# Altium schematic sheet PWR_IN.SchDoc
size C
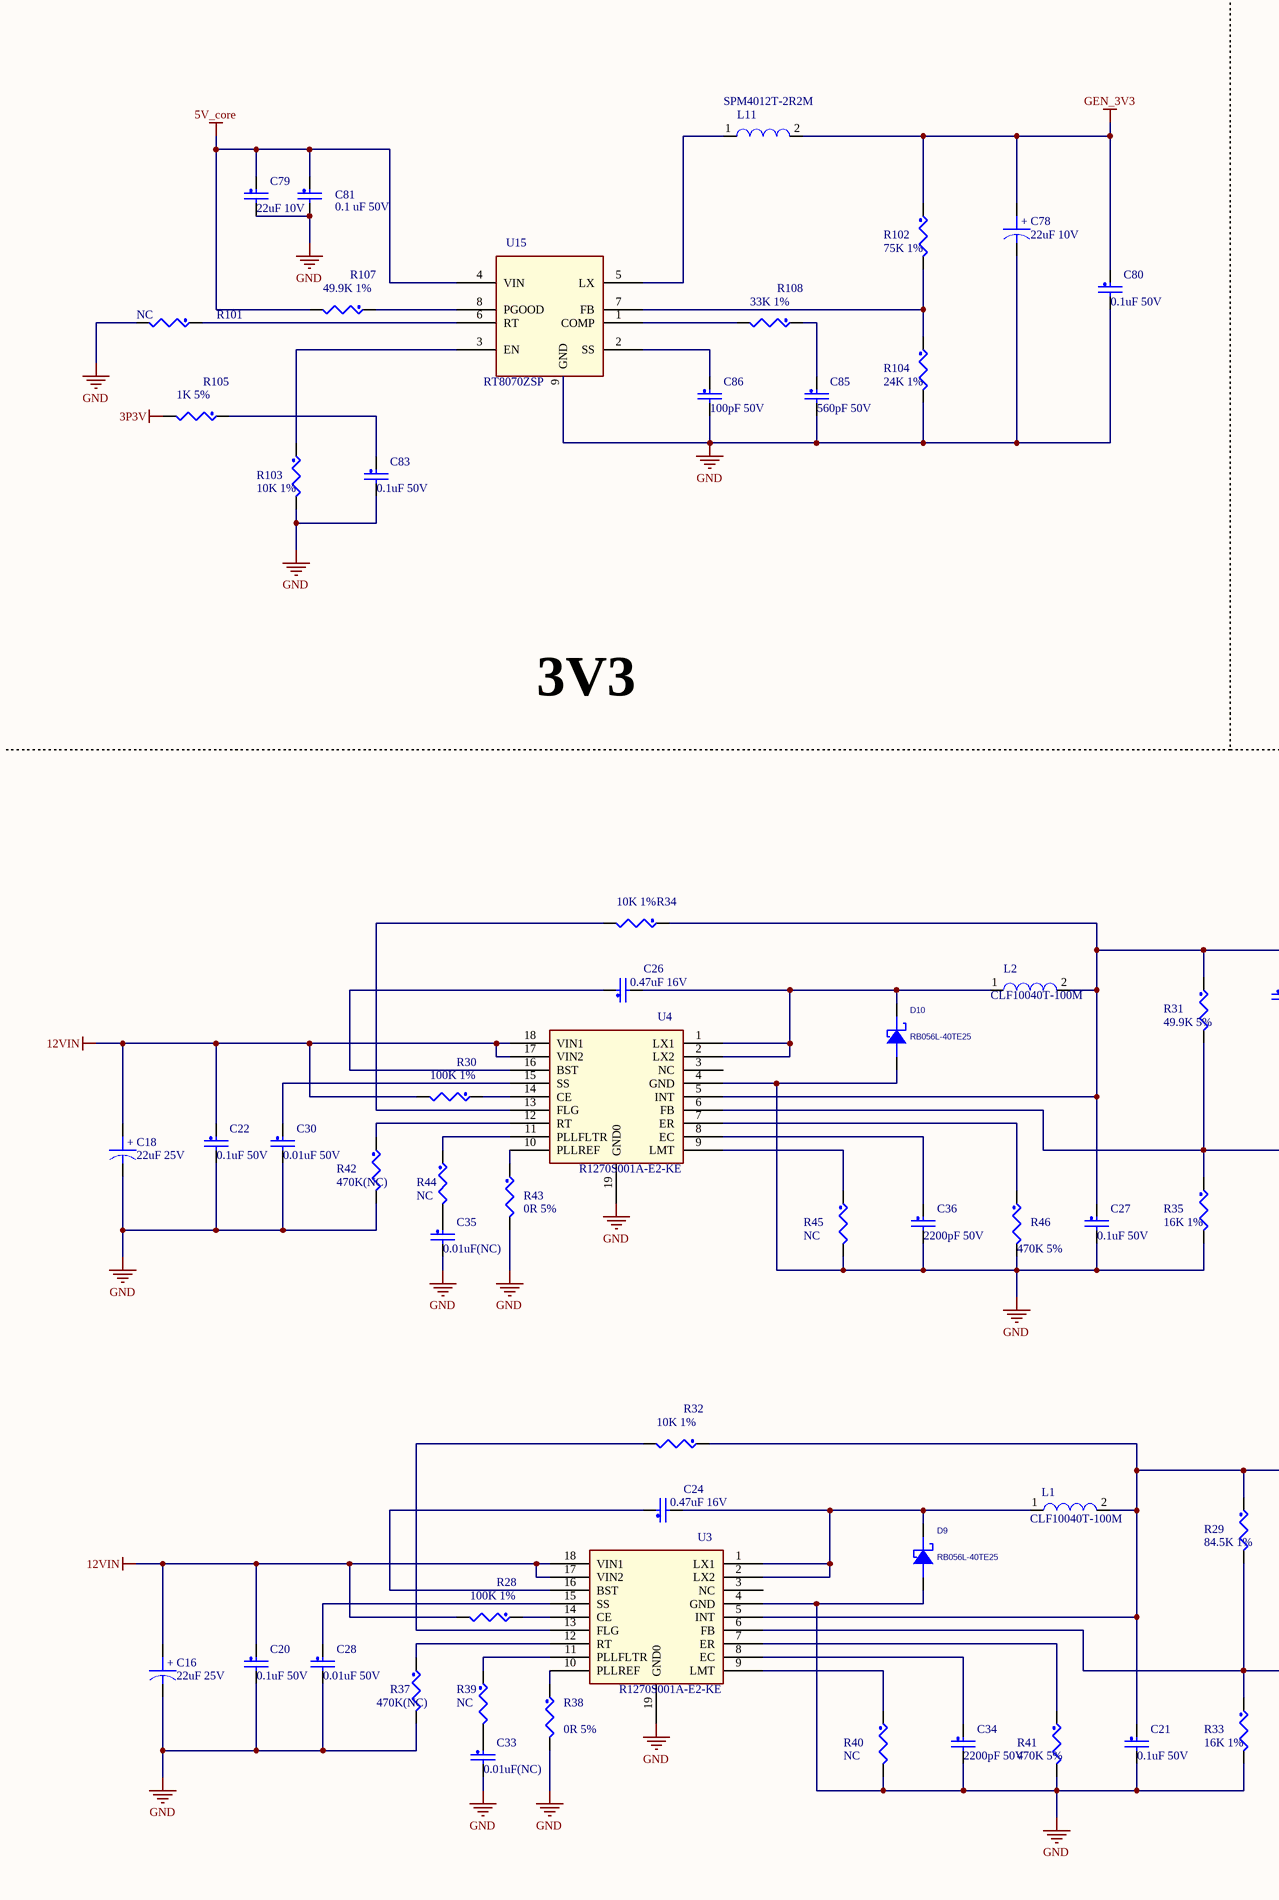
[diagram p0: PWR_IN.SchDoc, left]
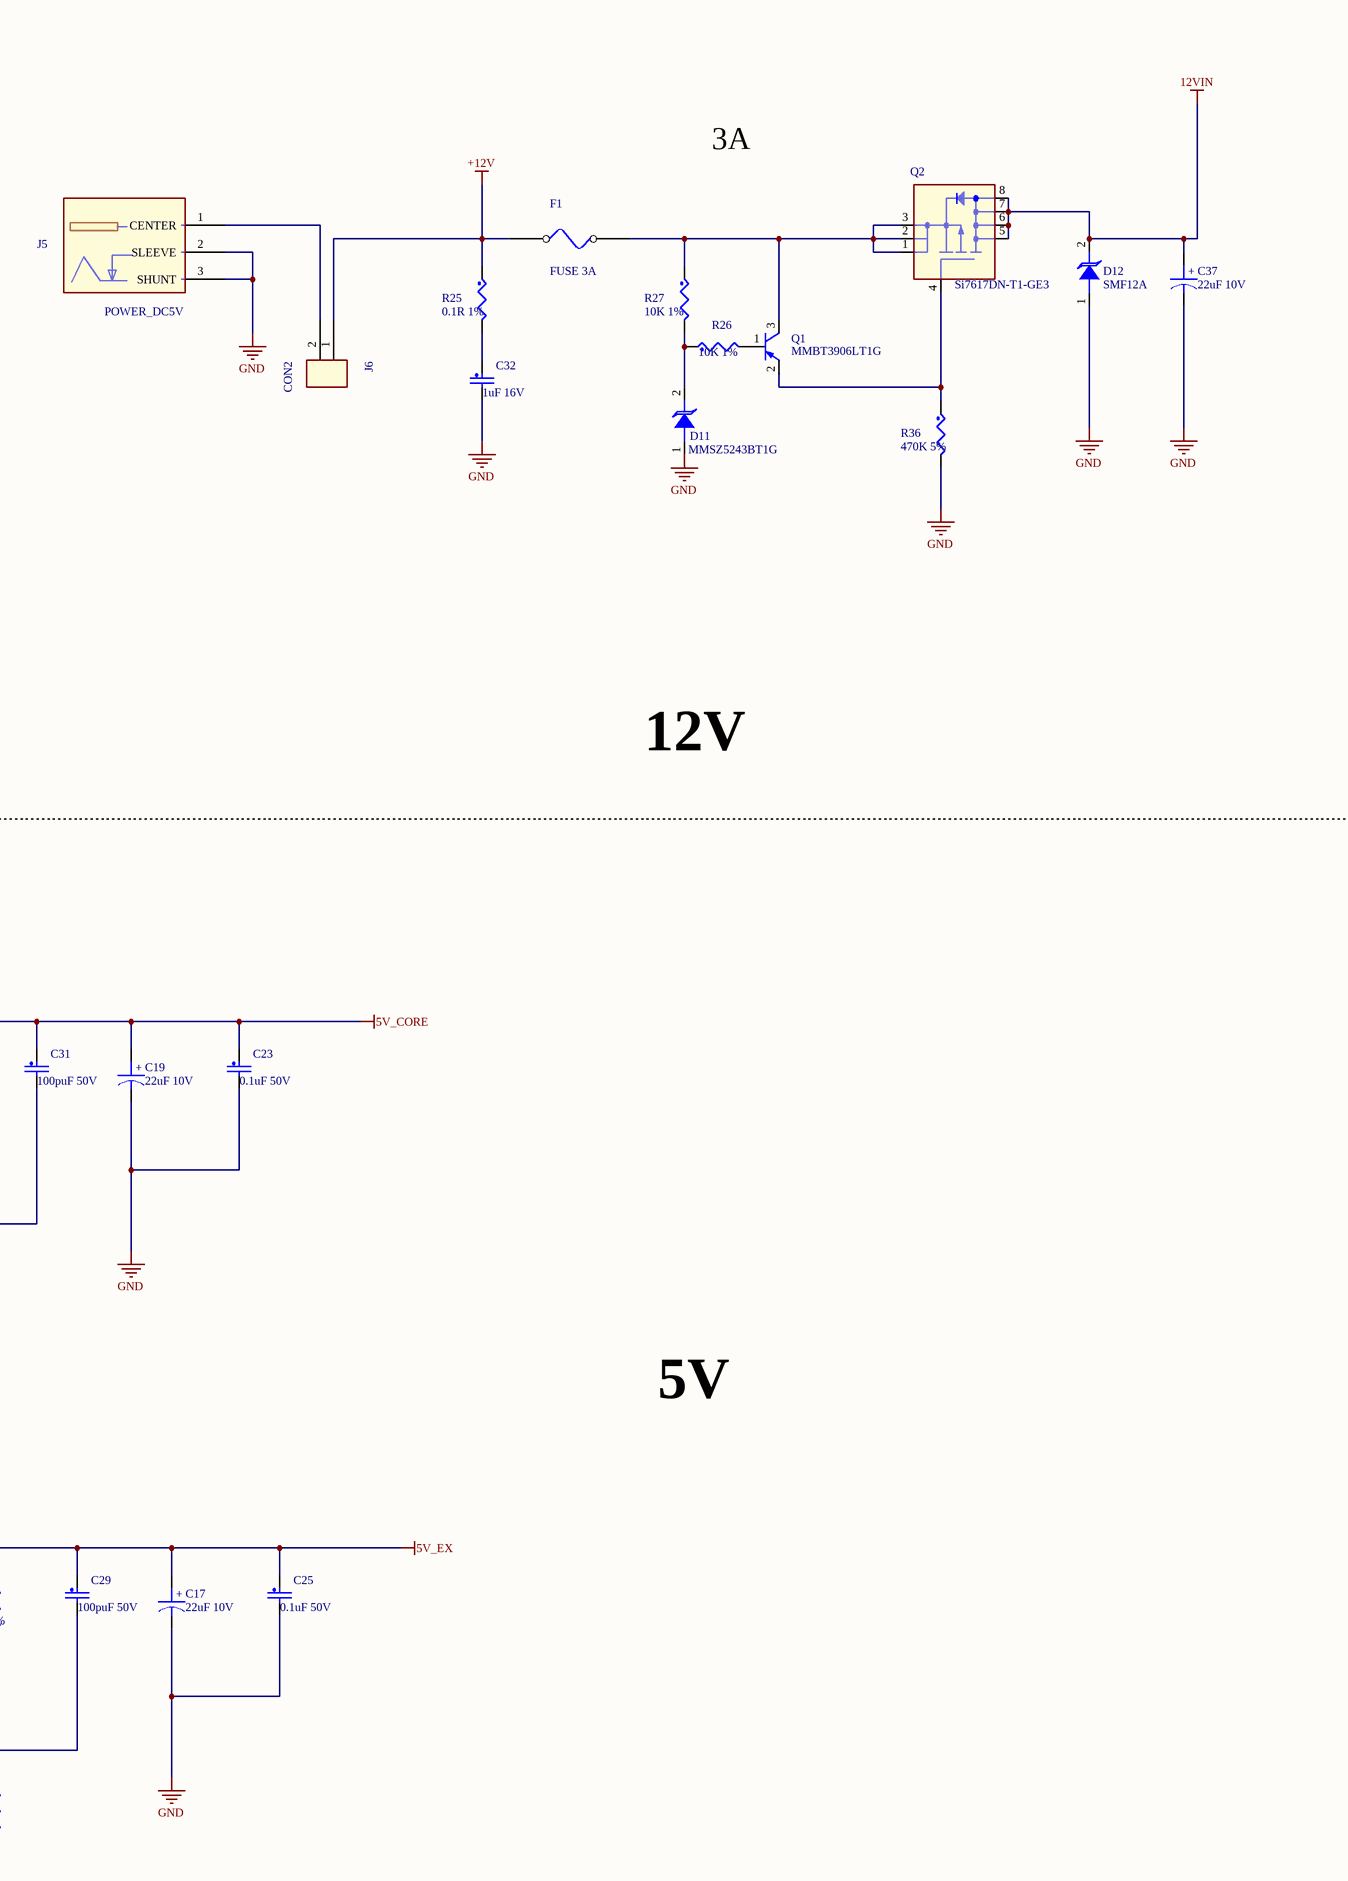
[diagram p1: PWR_IN.SchDoc, right]

## Parts
C16  22uF 25V  [SC0805]
C17  22uF 10V  [SC0805]
C18  22uF 25V  [SC0805]
C19  22uF 10V  [SC0805]
C20  0.1uF 50V  [SC0603]
C21  0.1uF 50V  [SC0603]
C22  0.1uF 50V  [SC0603]
C23  0.1uF 50V  [SC0603]
C24  0.47uF 16V  [SC0603]
C25  0.1uF 50V  [SC0603]
C26  0.47uF 16V  [SC0603]
C27  0.1uF 50V  [SC0603]
C28  0.01uF 50V  [SC0603]
C29  100puF 50V  [SC0603]
C30  0.01uF 50V  [SC0603]
C31  100puF 50V  [SC0603]
C32  1uF 16V  [SC0603]
C33  0.01uF(NC)  [SC0603]
C34  2200pF 50V  [SC0603]
C35  0.01uF(NC)  [SC0603]
C36  2200pF 50V  [SC0603]
C37  22uF 10V  [SC0805]
C78  22uF 10V  [SC0805]
C79  22uF 10V  [SC0603]
C80  0.1uF 50V  [SC0603]
C81  0.1 uF 50V  [SC0603]
C83  0.1uF 50V  [SC0603]
C85  560pF 50V  [SC0603]
C86  100pF 50V  [SC0603]
D9  RB056L-40TE25  [DO-214AC]
D10  RB056L-40TE25  [DO-214AC]
D11  MMSZ5243BT1G  [SOD123]
D12  SMF12A  [SOD123]
F1  FUSE 3A  [SF1812]
J5  POWER_DC5V  [DC-005-1P65]
J6  CON2  [SW2-10P4X15-1-8]
L1  CLF10040T-100M  [SPM10X9P7]
L2  CLF10040T-100M  [SPM10X9P7]
L11  SPM4012T-2R2M  [SPM4X4]
Q1  MMBT3906LT1G  [SOT23-3]
Q2  Si7617DN-T1-GE3  [QFN8-0P66-4P3X3P3]
R25  0.1R 1%  [SR0603]
R26  10K 1%  [SR0603]
R27  10K 1%  [SR0603]
R28  100K 1%  [SR0603]
R29  84.5K 1%  [SR0603]
R30  100K 1%  [SR0603]
R31  49.9K 5%  [SR0603]
R32  10K 1%  [SR0603]
R33  16K 1%  [SR0603]
R34  10K 1%  [SR0603]
R35  16K 1%  [SR0603]
R36  470K 5%  [SR0603]
R37  470K(NC)  [SR0603]
R38  0R 5%  [SR0603]
R39  NC  [SR0603]
R40  NC  [SR0603]
R41  470K 5%  [SR0603]
R42  470K(NC)  [SR0603]
R43  0R 5%  [SR0603]
R44  NC  [SR0603]
R45  NC  [SR0603]
R46  470K 5%  [SR0603]
R101  NC  [SR0603]
R102  75K 1%  [SR0603]
R103  10K 1%  [SR0603]
R104  24K 1%  [SR0603]
R105  1K 5%  [SR0603]
R107  49.9K 1%  [SR0603]
R108  33K 1%  [SR0603]
U3  R1270S001A-E2-KE  [HSOP18-0P5-5P2X4P4-P]
U4  R1270S001A-E2-KE  [HSOP18-0P5-5P2X4P4-P]
U15  RT8070ZSP  [SOP8-1P27-5X4-P]

## Nets
3P3V: R105.2
5V_core: C19.1 C23.1 C27.1 C31.1 C79.1 C81.1 L2.2 R31.1 R34.1 R107.2 U4.5(INT) U15.4(VIN)
5V_EX: C17.1 C21.1 C25.1 C29.1 L1.2 R29.1 R32.1 U3.5(INT)
12VIN: C16.1 C18.1 C20.1 C22.1 C37.1 D12.2(C) Q2.5(D5) Q2.6(D6) Q2.7(D7) Q2.8(D8) R28.2 R30.2 U3.17(VIN2) U3.18(VIN1) U4.17(VIN2) U4.18(VIN1)
+12V: F1.1 J6.1 R25.1
GEN_3V3: C78.1 C80.1 L11.2 R102.1
GND: C16.2 C17.2 C18.2 C19.2 C20.2 C21.2 C22.2 C23.2 C25.2 C27.2 C28.2 C30.2 C32.2 C33.2 C34.2 C35.2 C36.2 C37.2 C78.2 C79.2 C80.2 C81.2 C83.2 C85.2 C86.2 D9.1(ANODE) D10.1(ANODE) D11.1(A) D12.1(A) J5.2(SLEEVE) J5.3(SHUNT) R33.2 R35.2 R36.2 R37.2 R38.2 R40.2 R41.2 R42.2 R43.2 R45.2 R46.2 R101.2 R103.2 R104.2 U3.4(GND) U3.19(GND0) U4.4(GND) U4.19(GND0) U15.9(GND)
NetC24_1: C24.1 U3.16(BST)
NetC24_2: C24.2 D9.2(CATHODE) L1.1 U3.1(LX1) U3.2(LX2)
NetC26_1: C26.1 U4.16(BST)
NetC26_2: C26.2 D10.2(CATHODE) L2.1 U4.1(LX1) U4.2(LX2)
NetC28_1: C28.1 U3.15(SS)
NetC29_2: C29.2 R29.2 R33.1 U3.6(FB)
NetC30_1: C30.1 U4.15(SS)
NetC31_2: C31.2 R31.2 R35.1 U4.6(FB)
NetC32_1: C32.1 R25.2
NetC33_1: C33.1 R39.2
NetC34_1: C34.1 U3.8(EC)
NetC35_1: C35.1 R44.2
NetC36_1: C36.1 U4.8(EC)
NetC83_1: C83.1 R105.1
NetC85_1: C85.1 R108.1
NetC86_1: C86.1 U15.2(SS)
NetD11_2: D11.2(C) R26.1 R27.2
NetF1_2: F1.2 Q1.3(O) Q2.1(S1) Q2.2(S2) Q2.3(S3) R27.1
NetJ5_1: J5.1(CENTER) J6.2
NetL11_1: L11.1 U15.5(LX)
NetQ1_1: Q1.1(B) R26.2
NetQ1_2: Q1.2(E) Q2.4(G) R36.1
NetR28_1: R28.1 U3.14(CE)
NetR30_1: R30.1 U4.14(CE)
NetR32_2: R32.2 U3.13(FLG)
NetR34_2: R34.2 U4.13(FLG)
NetR37_1: R37.1 U3.12(RT)
NetR38_1: R38.1 U3.10(PLLREF)
NetR39_1: R39.1 U3.11(PLLFLTR)
NetR40_1: R40.1 U3.9(LMT)
NetR41_1: R41.1 U3.7(ER)
NetR42_1: R42.1 U4.12(RT)
NetR43_1: R43.1 U4.10(PLLREF)
NetR44_1: R44.1 U4.11(PLLFLTR)
NetR45_1: R45.1 U4.9(LMT)
NetR46_1: R46.1 U4.7(ER)
NetR101_1: R101.1 U15.6(RT)
NetR102_2: R102.2 R104.1 U15.7(FB)
NetR103_1: R103.1 U15.3(EN)
NetR107_1: R107.1 U15.8(PGOOD)
NetR108_2: R108.2 U15.1(COMP)

Not connected (* = marked no-connect by the designer): U3 3(NC); U4 3(NC)

## Notes on the sheet
- 3A
- 12V
- 3V3
- 5V
- (in symbol CAP POL) +

## Library data of the parts
C16-C19 C37 C78 = CAP POL
C20-C36 C79-C81 C83 C85 C86 = CAP_NP: CLASS: DISCRETE
D9 D10 = DIODE SCHOTTKY
D11 D12 = DIODE TAZ_5
F1 = FUSE
J5 = POWER_IN_1
L1 L2 L11 = INDUCTOR_Dup1: CLASS: DISCRETE
Q1 = PNP DIAC_0
R25-R46 R101-R105 R107 R108 = RES: CLASS: DISCRETE
U3 U4 = R1270S_2
U15 = SON8_2